# EAGLE design 6540 (EAGLE 6.6.0)
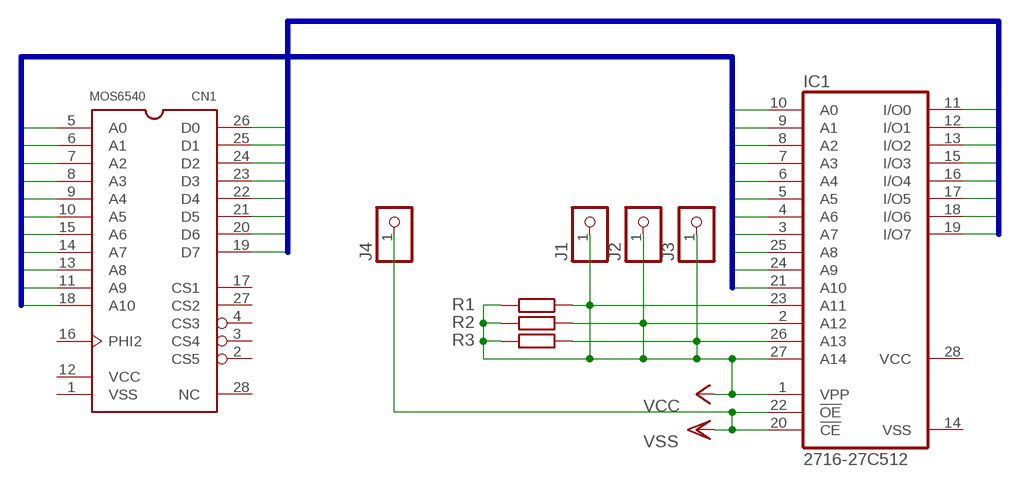
[diagram p0: schematic, sheet 1]

## Parts
CN1  MOS6540  [DIP-28]
IC1  2716-27C512  27C256AG  [DIL28-6]
J1  PINHD-1X1  [1X01]
J2  PINHD-1X1  [1X01]
J3  PINHD-1X1  [1X01]
J4  PINHD-1X1  [1X01]
R1  R-EU_M0805  [M0805]
R2  R-EU_M0805  [M0805]
R3  R-EU_M0805  [M0805]

## Nets
A0: CN1.5(A0) IC1.10(A0)
A1: CN1.6(A1) IC1.9(A1)
A2: CN1.7(A2) IC1.8(A2)
A3: CN1.8(A3) IC1.7(A3)
A4: CN1.9(A4) IC1.6(A4)
A5: CN1.10(A5) IC1.5(A5)
A6: CN1.15(A6) IC1.4(A6)
A7: CN1.14(A7) IC1.3(A7)
A8: CN1.13(A8) IC1.25(A8)
A9: CN1.11(A9) IC1.24(A9)
A10: CN1.18(A10) IC1.21(A10)
D0: CN1.26(D0) IC1.11(I/O0)
D1: CN1.25(D1) IC1.12(I/O1)
D2: CN1.24(D2) IC1.13(I/O2)
D3: CN1.23(D3) IC1.15(I/O3)
D4: CN1.22(D4) IC1.16(I/O4)
D5: CN1.21(D5) IC1.17(I/O5)
D6: CN1.20(D6) IC1.18(I/O6)
D7: CN1.19(D7) IC1.19(I/O7)
VCC: IC1.1(VPP) IC1.2(A12) IC1.23(A11) IC1.26(A13) IC1.27(A14) J1.1 J2.1 J3.1 R1.1 R1.2 R2.1 R2.2 R3.1 R3.2
VSS: IC1.20(!CE) IC1.22(!OE) J4.1
Unconnected: CN1.2(CS5) CN1.3(CS4) CN1.4(CS3) CN1.16(PHI2) CN1.17(CS1) CN1.27(CS2) CN1.28(NC)

## Buses
A[0..10]
D[0..7]

## Power pins joined to a net without a drawn wire
VCC: CN1.12(VCC) IC1.28(VCC)
VSS: CN1.1(VSS) IC1.14(VSS)

## Library data of the parts
CN1 = 65XXX:MOS6540
IC1 = memory-hitachi:27C256AG: MEMORY; OC_FARNELL: unknown; OC_NEWARK: unknown
J1-J4 = pinhead:PINHD-1X1: PIN HEADER
R1-R3 = rcl:R-EU_: RESISTOR, European symbol

## Board
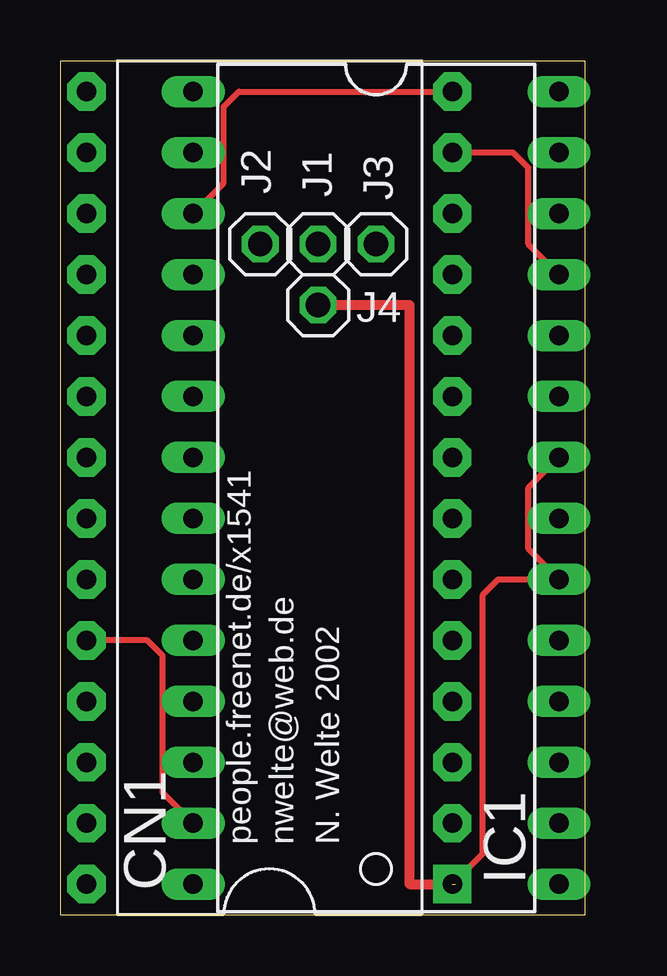
[diagram p1: board, top side]
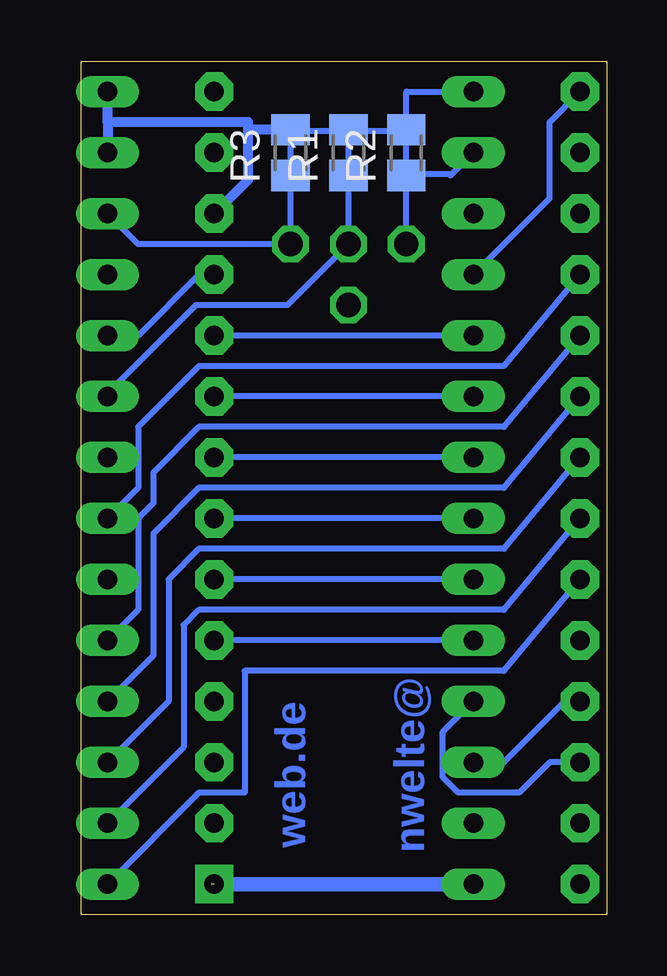
[diagram p2: board, bottom side, seen from below]

Size 21.89 x 35.55 mm. Coordinates in mm from the lower left corner, seen from the top.
Outline: 0,0 21.89,0 21.89,35.55 0,35.55 0,0
Copper layers (1*16): Top 0.035mm / dielectric 1.5mm / Bottom 0.035mm
Design rules "default *": minimum track width 10mil, minimum drill 24mil, track to track 8mil, track to pad 8mil, pad to pad 8mil, via to via 8mil, smd to smd 8mil, copper to edge 10mil, drill to drill 8mil, minimum pad ring 10mil, minimum via ring 8mil, stop-mask expansion 4mil, vias tented up to drill 0mil, thermal gap 10mil

### Footprints (pad centres in the part's own frame; a part is rotated, then mirrored left to right if it is on the bottom)
DIP-28 = drill 0.813 pad 1.6 square: 1 -15.24,-7.62 | drill 0.813 pad 1.6 octagon: 2 -12.7,-7.62; 3 -10.16,-7.62; 4 -7.62,-7.62; 5 -5.08,-7.62; 6 -2.54,-7.62; 7 0,-7.62; 8 2.54,-7.62; 9 5.08,-7.62; 10 7.62,-7.62; 11 10.16,-7.62; 12 12.7,-7.62; 13 15.24,-7.62; 14 17.78,-7.62; 15 17.78,7.62; 16 15.24,7.62; 17 12.7,7.62; 18 10.16,7.62; 19 7.62,7.62; 20 5.08,7.62; 21 2.54,7.62; 22 0,7.62; 23 -2.54,7.62; 24 -5.08,7.62; 25 -7.62,7.62; 26 -10.16,7.62; 27 -12.7,7.62; 28 -15.24,7.62
DIL28-6 = drill 0.813 long: 1 -16.51,-7.62; 2 -13.97,-7.62; 3 -11.43,-7.62; 4 -8.89,-7.62; 5 -6.35,-7.62; 6 -3.81,-7.62; 7 -1.27,-7.62; 8 1.27,-7.62; 9 3.81,-7.62; 10 6.35,-7.62; 11 8.89,-7.62; 12 11.43,-7.62; 13 13.97,-7.62; 14 16.51,-7.62; 15 16.51,7.62; 16 13.97,7.62; 17 11.43,7.62; 18 8.89,7.62; 19 6.35,7.62; 20 3.81,7.62; 21 1.27,7.62; 22 -1.27,7.62; 23 -3.81,7.62; 24 -6.35,7.62; 25 -8.89,7.62; 26 -11.43,7.62; 27 -13.97,7.62; 28 -16.51,7.62
1X01 = drill 1.016 octagon: 1 0,0
M0805 = smd 1.3 x 1.6: 1 -0.95,0; 2 0.95,0

### Placement (x,y rotation side)
CN1  8.72,16.51 90 top
IC1  13.17,17.78 270 top
J1  10.76,27.94 0 top
J2  8.34,27.94 0 top
J3  13.17,27.94 0 top
J4  10.76,25.39 0 top
R1  10.76,31.75 90 bottom
R2  8.34,31.75 90 bottom
R3  13.17,31.75 90 bottom

### Tracks (layer width: path | path; a pad name or v marks a point on that pad's centre or on a via)
A0
  Bottom 0.254: IC1.10 CN1.5
A1
  Bottom 0.254: IC1.9 CN1.6
A2
  Bottom 0.254: IC1.8 CN1.7
A3
  Bottom 0.254: IC1.7 CN1.8 15.71,19.05
A4
  Bottom 0.254: IC1.6 CN1.9
A5
  Bottom 0.254: IC1.5 CN1.10
A6
  Bottom 0.254: IC1.4 2.38,29.84 2.38,33.02 CN1.15
A7
  Top 0.254: IC1.3 6.82,30.48 6.82,33.65 7.46,34.28 CN1.14
A8
  Top 0.254: CN1.13 18.88,31.75 19.52,31.11 19.52,27.94 IC1.25
A9
  Bottom 0.254: IC1.24 19.52,24.12 16.98,26.67 CN1.11
A10
  Bottom 0.254: CN1.18 4.28,22.86 16.98,22.86 19.52,20.32 19.52,17.78 IC1.21
D0
  Bottom 0.254: CN1.26 2.38,6.34 3.65,5.08 6.18,5.08 6.82,5.71 6.82,7.62 IC1.11
D1
  Bottom 0.254: CN1.25 1.74,8.88 4.28,6.34 IC1.12
D2
  Top 0.254: IC1.13 4.28,5.08 4.28,10.79 3.65,11.42 CN1.24
D3
  Bottom 0.254: CN1.23 4.28,10.15 15.07,10.15 15.07,5.08 16.98,5.08 IC1.15
D4
  Bottom 0.254: CN1.22 4.28,12.69 16.98,12.69 17.61,12.06 17.61,6.98 IC1.16
D5
  Bottom 0.254: CN1.21 4.28,15.23 16.98,15.23 18.25,13.96 18.25,8.88 IC1.17
D6
  Bottom 0.254: CN1.20 4.28,17.78 16.98,17.78 18.88,15.87 18.88,10.79 IC1.18
D7
  Bottom 0.254: CN1.19 4.28,20.32 16.98,20.32 18.88,18.41 18.88,17.14 19.52,16.51 19.52,12.69 IC1.19
VCC
  Bottom 0.254: IC1.1 8.34,34.28 8.34,32.76 8.6,33.02 8.66,33.02 | 13.42,32.7 13.42,32.63 13.23,32.63 13.17,32.57 | 10.76,32.63 R1.2 10.7,32.63 8.4,32.63 R2.2 | 10.76,32.63 13.11,32.63 R3.2 13.17,32.57 | 13.17,32.57 13.17,32.51 R3.1 J3.1 19.52,27.94 IC1.26 | R2.2 8.66,33.02 | 8.66,33.02 8.72,33.02 | IC1.23 20.79,21.71 17.11,25.39 13.3,25.39 J1.1 R1.1 10.76,32.63 | IC1.2 6.5,30.8 6.56,30.86 8.34,30.86 | 8.34,30.86 R2.1 8.34,30.6 | J2.1 8.34,30.6 | 8.34,30.6 8.22,30.73 | 8.34,30.86 R2.2
  Bottom 0.406: 20.79,33.02 IC1.28 | 13.42,32.7 14.89,32.7 14.95,33.02 | 14.95,33.02 14.95,30.6 CN1.12 | 14.95,33.02 20.79,33.02 | 20.79,33.02 IC1.27 | 13.17,32.51 13.17,32.38
VSS  (1 unrouted)
  Top 0.254: CN1.1 17.61,2.54 17.61,13.33 18.25,13.96 IC1.20 19.52,15.23 19.52,17.78 IC1.22
  Top 0.406: J4.1 14.57,25.39 14.57,1.27 16.47,1.27
  Bottom 0.61: IC1.14 10.63,1.27 CN1.1

### Text on the board
Bottom: nwelte@ | web.de
tNames: people.freenet.de/x1541 | nwelte@web.de | N. Welte 2002